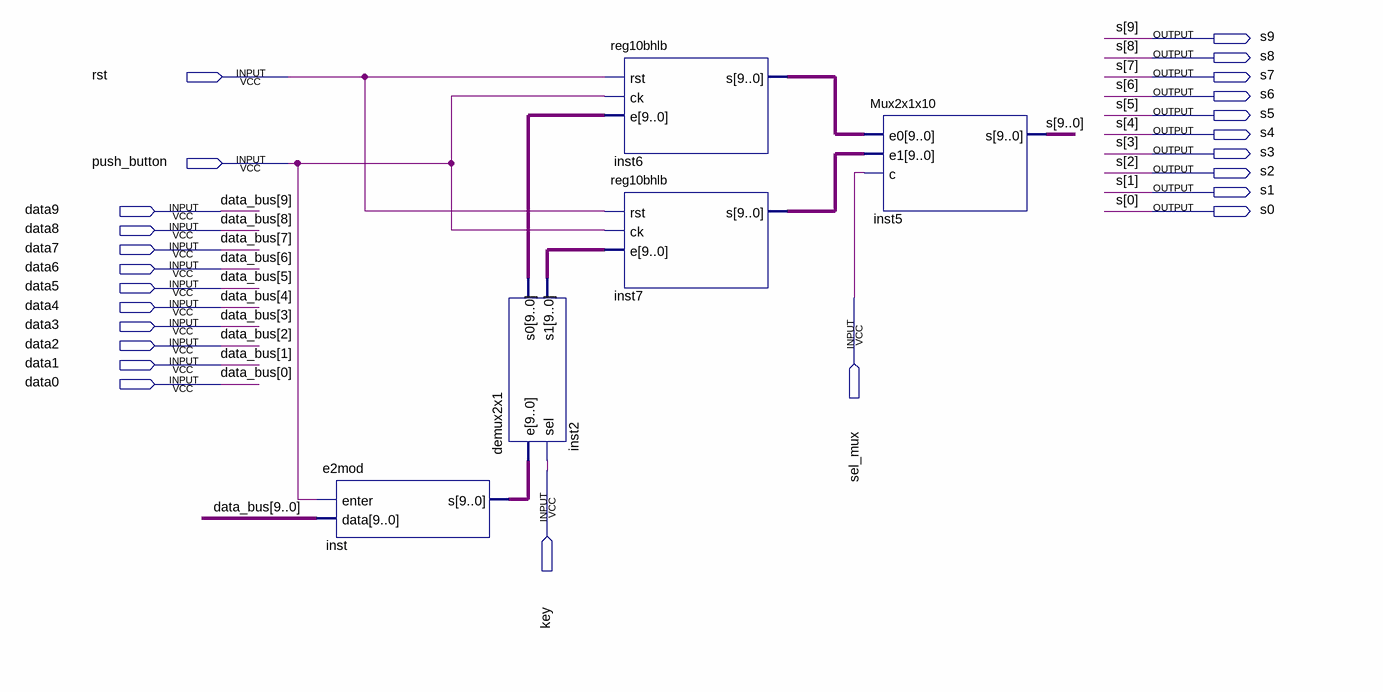
[diagram p0: schematic sheet]
// Quartus schematic dbreg.bdf as structural Verilog: 5 symbols, 24 pins
module dbreg (
  input  rst,
  input  push_button,
  input  data9,
  input  data8,
  input  data7,
  input  data6,
  input  data5,
  input  sel_mux,
  input  data4,
  input  data3,
  input  data2,
  input  data1,
  input  data0,
  input  key,
  output s9,
  output s8,
  output s7,
  output s6,
  output s5,
  output s4,
  output s3,
  output s2,
  output s1,
  output s0
);

  wire [9:0] inst2_s0, inst2_s1, inst6_s, inst7_s, inst_s;

  e2mod inst (
    .enter(push_button), .data({data9, data8, data7, data6, data5, data4, data3, data2, data1, data0}),
    .s(inst_s));
  demux2x1 inst2 (.e(inst_s), .sel(key), .s0(inst2_s0), .s1(inst2_s1));
  reg10bhlb inst6 (.rst(rst), .ck(push_button), .e(inst2_s0), .s(inst6_s));
  reg10bhlb inst7 (.rst(rst), .ck(push_button), .e(inst2_s1), .s(inst7_s));
  Mux2x1x10 inst5 (.e0(inst6_s), .e1(inst7_s), .c(sel_mux), .s({s9, s8, s7, s6, s5, s4, s3, s2, s1, s0}));

  // Other names for the same wires on the sheet: data_bus[9:0] = {data9, data8, data7, data6, data5, data4, data3, data2, data1, data0}
endmodule
